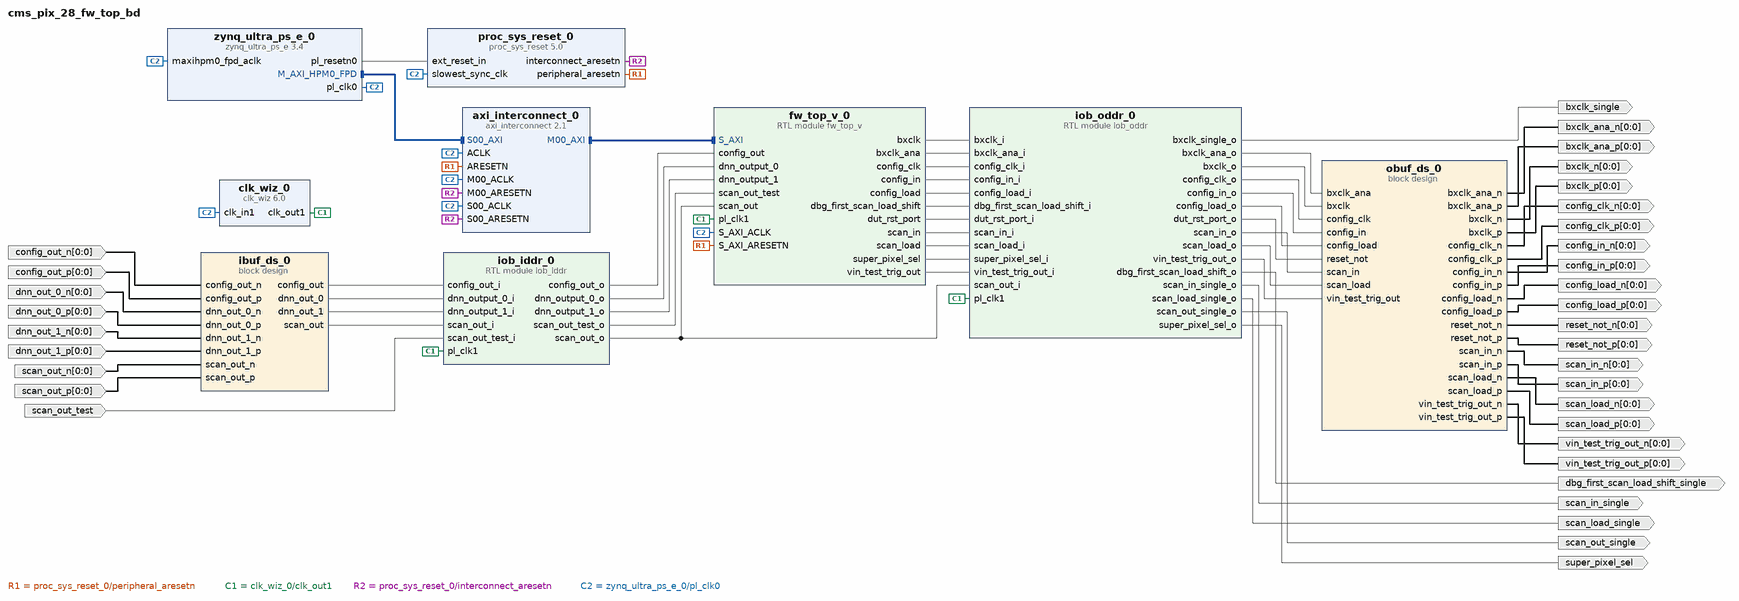
[diagram p0: block diagram of the top level]
# Vivado block design cms_pix_28_fw_top_bd, xczu9eg-ffvb1156-2-e, Vivado 2022.1
create_bd_design cms_pix_28_fw_top_bd

create_bd_port -dir O super_pixel_sel
create_bd_port -dir I scan_out_test
create_bd_port -dir I -from 0 -to 0 -type data config_out_p
create_bd_port -dir I -from 0 -to 0 -type data config_out_n
create_bd_port -dir I -from 0 -to 0 -type data scan_out_p
create_bd_port -dir I -from 0 -to 0 -type data scan_out_n
create_bd_port -dir I -from 0 -to 0 -type data dnn_out_0_p
create_bd_port -dir I -from 0 -to 0 -type data dnn_out_0_n
create_bd_port -dir I -from 0 -to 0 -type data dnn_out_1_p
create_bd_port -dir I -from 0 -to 0 -type data dnn_out_1_n
create_bd_port -dir O -from 0 -to 0 -type data scan_load_n
create_bd_port -dir O -from 0 -to 0 -type data scan_load_p
create_bd_port -dir O -from 0 -to 0 -type data scan_in_n
create_bd_port -dir O -from 0 -to 0 -type data scan_in_p
create_bd_port -dir O -from 0 -to 0 -type data vin_test_trig_out_n
create_bd_port -dir O -from 0 -to 0 -type data vin_test_trig_out_p
create_bd_port -dir O -from 0 -to 0 -type data bxclk_n
create_bd_port -dir O -from 0 -to 0 -type data bxclk_p
create_bd_port -dir O -from 0 -to 0 -type data bxclk_ana_n
create_bd_port -dir O -from 0 -to 0 -type data bxclk_ana_p
create_bd_port -dir O -from 0 -to 0 -type data config_load_n
create_bd_port -dir O -from 0 -to 0 -type data config_load_p
create_bd_port -dir O -from 0 -to 0 -type data config_in_n
create_bd_port -dir O -from 0 -to 0 -type data config_in_p
create_bd_port -dir O -from 0 -to 0 -type data config_clk_p
create_bd_port -dir O -from 0 -to 0 -type data config_clk_n
create_bd_port -dir O -from 0 -to 0 -type data reset_not_p
create_bd_port -dir O -from 0 -to 0 -type data reset_not_n
create_bd_port -dir O bxclk_single
create_bd_port -dir O scan_in_single
create_bd_port -dir O scan_out_single
create_bd_port -dir O scan_load_single
create_bd_port -dir O dbg_first_scan_load_shift_single

create_bd_cell -type ip -vlnv xilinx.com:ip:proc_sys_reset:5.0 proc_sys_reset_0
create_bd_cell -type ip -vlnv xilinx.com:ip:axi_interconnect:2.1 axi_interconnect_0
set_property -dict {CONFIG.NUM_MI 1} [get_bd_cells axi_interconnect_0]
create_bd_cell -type ip -vlnv xilinx.com:ip:zynq_ultra_ps_e:3.4 zynq_ultra_ps_e_0
set_property -dict [list \
  CONFIG.CAN0_BOARD_INTERFACE custom \
  CONFIG.CAN1_BOARD_INTERFACE custom \
  CONFIG.CSU_BOARD_INTERFACE custom \
  CONFIG.DP_BOARD_INTERFACE custom \
  CONFIG.GEM0_BOARD_INTERFACE custom \
  CONFIG.GEM1_BOARD_INTERFACE custom \
  CONFIG.GEM2_BOARD_INTERFACE custom \
  CONFIG.GEM3_BOARD_INTERFACE custom \
  CONFIG.GPIO_BOARD_INTERFACE custom \
  CONFIG.IIC0_BOARD_INTERFACE custom \
  CONFIG.IIC1_BOARD_INTERFACE custom \
  CONFIG.NAND_BOARD_INTERFACE custom \
  CONFIG.PCIE_BOARD_INTERFACE custom \
  CONFIG.PJTAG_BOARD_INTERFACE custom \
  CONFIG.PMU_BOARD_INTERFACE custom \
  CONFIG.PSU_BANK_0_IO_STANDARD LVCMOS33 \
  CONFIG.PSU_BANK_1_IO_STANDARD LVCMOS33 \
  CONFIG.PSU_BANK_2_IO_STANDARD LVCMOS33 \
  CONFIG.PSU_BANK_3_IO_STANDARD LVCMOS33 \
  CONFIG.PSU_USB3__DUAL_CLOCK_ENABLE 0 \
  CONFIG.PSU__CAN1__PERIPHERAL__ENABLE 0 \
  CONFIG.PSU__CRF_APB__ACPU_CTRL__FREQMHZ 1333.333 \
  CONFIG.PSU__CRF_APB__ACPU_CTRL__SRCSEL APLL \
  CONFIG.PSU__CRF_APB__APLL_CTRL__SRCSEL PSS_REF_CLK \
  CONFIG.PSU__CRF_APB__DBG_FPD_CTRL__FREQMHZ 250 \
  CONFIG.PSU__CRF_APB__DBG_FPD_CTRL__SRCSEL IOPLL \
  CONFIG.PSU__CRF_APB__DBG_TRACE_CTRL__FREQMHZ 250 \
  CONFIG.PSU__CRF_APB__DBG_TRACE_CTRL__SRCSEL IOPLL \
  CONFIG.PSU__CRF_APB__DBG_TSTMP_CTRL__FREQMHZ 250 \
  CONFIG.PSU__CRF_APB__DBG_TSTMP_CTRL__SRCSEL IOPLL \
  CONFIG.PSU__CRF_APB__DDR_CTRL__FREQMHZ 800 \
  CONFIG.PSU__CRF_APB__DDR_CTRL__SRCSEL DPLL \
  CONFIG.PSU__CRF_APB__DPDMA_REF_CTRL__FREQMHZ 600 \
  CONFIG.PSU__CRF_APB__DPDMA_REF_CTRL__SRCSEL DPLL \
  CONFIG.PSU__CRF_APB__DPLL_CTRL__SRCSEL PSS_REF_CLK \
  CONFIG.PSU__CRF_APB__DP_AUDIO_REF_CTRL__SRCSEL VPLL \
  CONFIG.PSU__CRF_APB__DP_STC_REF_CTRL__SRCSEL VPLL \
  CONFIG.PSU__CRF_APB__DP_VIDEO_REF_CTRL__SRCSEL DPLL \
  CONFIG.PSU__CRF_APB__GDMA_REF_CTRL__FREQMHZ 600 \
  CONFIG.PSU__CRF_APB__GDMA_REF_CTRL__SRCSEL DPLL \
  CONFIG.PSU__CRF_APB__GPU_REF_CTRL__FREQMHZ 600 \
  CONFIG.PSU__CRF_APB__GPU_REF_CTRL__SRCSEL DPLL \
  CONFIG.PSU__CRF_APB__TOPSW_LSBUS_CTRL__FREQMHZ 100 \
  CONFIG.PSU__CRF_APB__TOPSW_LSBUS_CTRL__SRCSEL IOPLL \
  CONFIG.PSU__CRF_APB__TOPSW_MAIN_CTRL__FREQMHZ 533.333 \
  CONFIG.PSU__CRF_APB__TOPSW_MAIN_CTRL__SRCSEL VPLL \
  CONFIG.PSU__CRF_APB__VPLL_CTRL__SRCSEL PSS_REF_CLK \
  CONFIG.PSU__CRL_APB__ADMA_REF_CTRL__FREQMHZ 533.333 \
  CONFIG.PSU__CRL_APB__ADMA_REF_CTRL__SRCSEL RPLL \
  CONFIG.PSU__CRL_APB__CAN1_REF_CTRL__FREQMHZ 100 \
  CONFIG.PSU__CRL_APB__CAN1_REF_CTRL__SRCSEL IOPLL \
  CONFIG.PSU__CRL_APB__CPU_R5_CTRL__FREQMHZ 533.333 \
  CONFIG.PSU__CRL_APB__CPU_R5_CTRL__SRCSEL RPLL \
  CONFIG.PSU__CRL_APB__DBG_LPD_CTRL__FREQMHZ 250 \
  CONFIG.PSU__CRL_APB__DBG_LPD_CTRL__SRCSEL IOPLL \
  CONFIG.PSU__CRL_APB__GEM3_REF_CTRL__FREQMHZ 125 \
  CONFIG.PSU__CRL_APB__GEM3_REF_CTRL__SRCSEL IOPLL \
  CONFIG.PSU__CRL_APB__I2C0_REF_CTRL__FREQMHZ 100 \
  CONFIG.PSU__CRL_APB__I2C0_REF_CTRL__SRCSEL IOPLL \
  CONFIG.PSU__CRL_APB__I2C1_REF_CTRL__FREQMHZ 100 \
  CONFIG.PSU__CRL_APB__I2C1_REF_CTRL__SRCSEL IOPLL \
  CONFIG.PSU__CRL_APB__IOPLL_CTRL__SRCSEL PSS_REF_CLK \
  CONFIG.PSU__CRL_APB__IOU_SWITCH_CTRL__FREQMHZ 267 \
  CONFIG.PSU__CRL_APB__IOU_SWITCH_CTRL__SRCSEL RPLL \
  CONFIG.PSU__CRL_APB__LPD_LSBUS_CTRL__FREQMHZ 100 \
  CONFIG.PSU__CRL_APB__LPD_LSBUS_CTRL__SRCSEL IOPLL \
  CONFIG.PSU__CRL_APB__LPD_SWITCH_CTRL__FREQMHZ 533.333 \
  CONFIG.PSU__CRL_APB__LPD_SWITCH_CTRL__SRCSEL RPLL \
  CONFIG.PSU__CRL_APB__PCAP_CTRL__FREQMHZ 200 \
  CONFIG.PSU__CRL_APB__PCAP_CTRL__SRCSEL IOPLL \
  CONFIG.PSU__CRL_APB__PL0_REF_CTRL__FREQMHZ 100 \
  CONFIG.PSU__CRL_APB__PL0_REF_CTRL__SRCSEL IOPLL \
  CONFIG.PSU__CRL_APB__QSPI_REF_CTRL__FREQMHZ 300 \
  CONFIG.PSU__CRL_APB__QSPI_REF_CTRL__SRCSEL IOPLL \
  CONFIG.PSU__CRL_APB__RPLL_CTRL__SRCSEL PSS_REF_CLK \
  CONFIG.PSU__CRL_APB__SDIO1_REF_CTRL__FREQMHZ 200 \
  CONFIG.PSU__CRL_APB__SDIO1_REF_CTRL__SRCSEL RPLL \
  CONFIG.PSU__CRL_APB__TIMESTAMP_REF_CTRL__FREQMHZ 100 \
  CONFIG.PSU__CRL_APB__TIMESTAMP_REF_CTRL__SRCSEL PSS_REF_CLK \
  CONFIG.PSU__CRL_APB__UART0_REF_CTRL__FREQMHZ 100 \
  CONFIG.PSU__CRL_APB__UART0_REF_CTRL__SRCSEL IOPLL \
  CONFIG.PSU__CRL_APB__UART1_REF_CTRL__FREQMHZ 100 \
  CONFIG.PSU__CRL_APB__UART1_REF_CTRL__SRCSEL IOPLL \
  CONFIG.PSU__CRL_APB__USB0_BUS_REF_CTRL__FREQMHZ 250 \
  CONFIG.PSU__CRL_APB__USB0_BUS_REF_CTRL__SRCSEL IOPLL \
  CONFIG.PSU__CRL_APB__USB3_DUAL_REF_CTRL__FREQMHZ 20 \
  CONFIG.PSU__CRL_APB__USB3_DUAL_REF_CTRL__SRCSEL IOPLL \
  CONFIG.PSU__CRL_APB__USB3__ENABLE 0 \
  CONFIG.PSU__CSUPMU__PERIPHERAL__VALID 0 \
  CONFIG.PSU__DDRC__BUS_WIDTH {64 Bit} \
  CONFIG.PSU__DDRC__COMPONENTS Components \
  CONFIG.PSU__DDRC__DEVICE_CAPACITY {2048 MBits} \
  CONFIG.PSU__DDRC__DRAM_WIDTH {8 Bits} \
  CONFIG.PSU__DDRC__ECC Disabled \
  CONFIG.PSU__DDRC__MEMORY_TYPE {DDR 4} \
  CONFIG.PSU__DDRC__SPEED_BIN DDR4_1600J \
  CONFIG.PSU__DDR_HIGH_ADDRESS_GUI_ENABLE 0 \
  CONFIG.PSU__DDR__INTERFACE__FREQMHZ 400.000 \
  CONFIG.PSU__DEVICE_TYPE EG \
  CONFIG.PSU__DISPLAYPORT__PERIPHERAL__ENABLE 0 \
  CONFIG.PSU__DLL__ISUSED 0 \
  CONFIG.PSU__ENET3__PERIPHERAL__ENABLE 0 \
  CONFIG.PSU__FPD_SLCR__WDT1__FREQMHZ 100 \
  CONFIG.PSU__FPGA_PL0_ENABLE 1 \
  CONFIG.PSU__GPIO0_MIO__PERIPHERAL__ENABLE 0 \
  CONFIG.PSU__GPIO1_MIO__PERIPHERAL__ENABLE 0 \
  CONFIG.PSU__I2C0__PERIPHERAL__ENABLE 0 \
  CONFIG.PSU__I2C1__PERIPHERAL__ENABLE 0 \
  CONFIG.PSU__IOU_SLCR__IOU_TTC_APB_CLK__TTC0_SEL APB \
  CONFIG.PSU__IOU_SLCR__IOU_TTC_APB_CLK__TTC1_SEL APB \
  CONFIG.PSU__IOU_SLCR__IOU_TTC_APB_CLK__TTC2_SEL APB \
  CONFIG.PSU__IOU_SLCR__IOU_TTC_APB_CLK__TTC3_SEL APB \
  CONFIG.PSU__IOU_SLCR__TTC0__FREQMHZ 100 \
  CONFIG.PSU__IOU_SLCR__TTC1__FREQMHZ 100 \
  CONFIG.PSU__IOU_SLCR__TTC2__FREQMHZ 100 \
  CONFIG.PSU__IOU_SLCR__TTC3__FREQMHZ 100 \
  CONFIG.PSU__IOU_SLCR__WDT0__FREQMHZ 100 \
  CONFIG.PSU__LPD_SLCR__CSUPMU__FREQMHZ 100 \
  CONFIG.PSU__MAXIGP0__DATA_WIDTH 128 \
  CONFIG.PSU__OVERRIDE_HPX_QOS 0 \
  CONFIG.PSU__OVERRIDE__BASIC_CLOCK 0 \
  CONFIG.PSU__PMU__PERIPHERAL__ENABLE 0 \
  CONFIG.PSU__PRESET_APPLIED 0 \
  CONFIG.PSU__PSS_REF_CLK__FREQMHZ 33.333 \
  CONFIG.PSU__QSPI__PERIPHERAL__ENABLE 0 \
  CONFIG.PSU__SATA__PERIPHERAL__ENABLE 0 \
  CONFIG.PSU__SD0__CLK_100_SDR_OTAP_DLY 0x3 \
  CONFIG.PSU__SD0__CLK_200_SDR_OTAP_DLY 0x3 \
  CONFIG.PSU__SD0__CLK_50_DDR_ITAP_DLY 0x3D \
  CONFIG.PSU__SD0__CLK_50_DDR_OTAP_DLY 0x4 \
  CONFIG.PSU__SD0__CLK_50_SDR_ITAP_DLY 0x15 \
  CONFIG.PSU__SD0__CLK_50_SDR_OTAP_DLY 0x5 \
  CONFIG.PSU__SD1__CLK_100_SDR_OTAP_DLY 0x3 \
  CONFIG.PSU__SD1__CLK_200_SDR_OTAP_DLY 0x3 \
  CONFIG.PSU__SD1__CLK_50_DDR_ITAP_DLY 0x3D \
  CONFIG.PSU__SD1__CLK_50_DDR_OTAP_DLY 0x4 \
  CONFIG.PSU__SD1__CLK_50_SDR_ITAP_DLY 0x15 \
  CONFIG.PSU__SD1__CLK_50_SDR_OTAP_DLY 0x5 \
  CONFIG.PSU__SD1__PERIPHERAL__ENABLE 0 \
  CONFIG.PSU__SWDT0__PERIPHERAL__ENABLE 0 \
  CONFIG.PSU__SWDT1__PERIPHERAL__ENABLE 0 \
  CONFIG.PSU__TTC0__PERIPHERAL__ENABLE 0 \
  CONFIG.PSU__TTC1__PERIPHERAL__ENABLE 0 \
  CONFIG.PSU__TTC2__PERIPHERAL__ENABLE 0 \
  CONFIG.PSU__TTC3__PERIPHERAL__ENABLE 0 \
  CONFIG.PSU__UART0__PERIPHERAL__ENABLE 0 \
  CONFIG.PSU__UART1__PERIPHERAL__ENABLE 0 \
  CONFIG.PSU__USB0__PERIPHERAL__ENABLE 0 \
  CONFIG.PSU__USE__IRQ0 0 \
  CONFIG.PSU__USE__M_AXI_GP0 1 \
  CONFIG.PSU__USE__M_AXI_GP1 0 \
  CONFIG.PSU__USE__M_AXI_GP2 0 \
  CONFIG.QSPI_BOARD_INTERFACE custom \
  CONFIG.SATA_BOARD_INTERFACE custom \
  CONFIG.SD0_BOARD_INTERFACE custom \
  CONFIG.SD1_BOARD_INTERFACE custom \
  CONFIG.SPI0_BOARD_INTERFACE custom \
  CONFIG.SPI1_BOARD_INTERFACE custom \
  CONFIG.SUBPRESET1 Custom \
  CONFIG.SUBPRESET2 Custom \
  CONFIG.SWDT0_BOARD_INTERFACE custom \
  CONFIG.SWDT1_BOARD_INTERFACE custom \
  CONFIG.TRACE_BOARD_INTERFACE custom \
  CONFIG.TTC0_BOARD_INTERFACE custom \
  CONFIG.TTC1_BOARD_INTERFACE custom \
  CONFIG.TTC2_BOARD_INTERFACE custom \
  CONFIG.TTC3_BOARD_INTERFACE custom \
  CONFIG.UART0_BOARD_INTERFACE custom \
  CONFIG.UART1_BOARD_INTERFACE custom \
  CONFIG.USB0_BOARD_INTERFACE custom \
  CONFIG.USB1_BOARD_INTERFACE custom \
  CONFIG.preset None \
] [get_bd_cells zynq_ultra_ps_e_0]
# 747 more settings of zynq_ultra_ps_e_0 are not shown: defaults, MIO pin electricals, DDR timing, and values the tool derives
create_bd_cell -type container -reference ibuf_ds ibuf_ds_0
set_property -dict [list \
  CONFIG.ACTIVE_SIM_BD ibuf_ds.bd \
  CONFIG.ACTIVE_SYNTH_BD ibuf_ds.bd \
  CONFIG.ENABLE_DFX 0 \
  CONFIG.LIST_SIM_BD ibuf_ds.bd \
  CONFIG.LIST_SYNTH_BD ibuf_ds.bd \
  CONFIG.LOCK_PROPAGATE 0 \
] [get_bd_cells ibuf_ds_0]
create_bd_cell -type container -reference obuf_ds obuf_ds_0
set_property -dict [list \
  CONFIG.ACTIVE_SIM_BD obuf_ds.bd \
  CONFIG.ACTIVE_SYNTH_BD obuf_ds.bd \
  CONFIG.ENABLE_DFX 0 \
  CONFIG.LIST_SIM_BD obuf_ds.bd \
  CONFIG.LIST_SYNTH_BD obuf_ds.bd \
  CONFIG.LOCK_PROPAGATE 0 \
] [get_bd_cells obuf_ds_0]
create_bd_cell -type ip -vlnv xilinx.com:ip:clk_wiz:6.0 clk_wiz_0
set_property -dict [list \
  CONFIG.AUTO_PRIMITIVE MMCM \
  CONFIG.CLKOUT1_DRIVES Buffer \
  CONFIG.CLKOUT1_JITTER 90.075 \
  CONFIG.CLKOUT1_PHASE_ERROR 87.181 \
  CONFIG.CLKOUT1_REQUESTED_OUT_FREQ 399.99600 \
  CONFIG.CLKOUT2_DRIVES Buffer \
  CONFIG.CLKOUT3_DRIVES Buffer \
  CONFIG.CLKOUT4_DRIVES Buffer \
  CONFIG.CLKOUT5_DRIVES Buffer \
  CONFIG.CLKOUT6_DRIVES Buffer \
  CONFIG.CLKOUT7_DRIVES Buffer \
  CONFIG.FEEDBACK_SOURCE FDBK_AUTO \
  CONFIG.MMCM_BANDWIDTH OPTIMIZED \
  CONFIG.MMCM_CLKFBOUT_MULT_F 12.000 \
  CONFIG.MMCM_CLKOUT0_DIVIDE_F 3.000 \
  CONFIG.MMCM_COMPENSATION AUTO \
  CONFIG.OPTIMIZE_CLOCKING_STRUCTURE_EN true \
  CONFIG.PRIMITIVE Auto \
  CONFIG.PRIM_SOURCE No_buffer \
  CONFIG.SECONDARY_SOURCE Single_ended_clock_capable_pin \
  CONFIG.USE_LOCKED false \
  CONFIG.USE_PHASE_ALIGNMENT true \
  CONFIG.USE_RESET false \
] [get_bd_cells clk_wiz_0]
create_bd_cell -type module -reference iob_iddr iob_iddr_0
create_bd_cell -type module -reference iob_oddr iob_oddr_0
create_bd_cell -type module -reference fw_top_v fw_top_v_0

# ---- connections ----

connect_bd_intf_net [get_bd_intf_pins fw_top_v_0/S_AXI] [get_bd_intf_pins axi_interconnect_0/M00_AXI]
connect_bd_intf_net [get_bd_intf_pins zynq_ultra_ps_e_0/M_AXI_HPM0_FPD] [get_bd_intf_pins axi_interconnect_0/S00_AXI]
connect_bd_net -net ARESETN_1 [get_bd_pins proc_sys_reset_0/peripheral_aresetn] \
  [get_bd_pins axi_interconnect_0/ARESETN] [get_bd_pins fw_top_v_0/S_AXI_ARESETN]
connect_bd_net [get_bd_pins clk_wiz_0/clk_out1] [get_bd_pins iob_iddr_0/pl_clk1] [get_bd_pins iob_oddr_0/pl_clk1] [get_bd_pins fw_top_v_0/pl_clk1]
connect_bd_net [get_bd_ports config_out_n] [get_bd_pins ibuf_ds_0/config_out_n]
connect_bd_net [get_bd_ports config_out_p] [get_bd_pins ibuf_ds_0/config_out_p]
connect_bd_net [get_bd_ports dnn_out_0_n] [get_bd_pins ibuf_ds_0/dnn_out_0_n]
connect_bd_net [get_bd_ports dnn_out_0_p] [get_bd_pins ibuf_ds_0/dnn_out_0_p]
connect_bd_net [get_bd_ports dnn_out_1_n] [get_bd_pins ibuf_ds_0/dnn_out_1_n]
connect_bd_net [get_bd_ports dnn_out_1_p] [get_bd_pins ibuf_ds_0/dnn_out_1_p]
connect_bd_net [get_bd_pins fw_top_v_0/bxclk] [get_bd_pins iob_oddr_0/bxclk_i]
connect_bd_net [get_bd_pins fw_top_v_0/bxclk_ana] [get_bd_pins iob_oddr_0/bxclk_ana_i]
connect_bd_net [get_bd_pins fw_top_v_0/config_clk] [get_bd_pins iob_oddr_0/config_clk_i]
connect_bd_net [get_bd_pins fw_top_v_0/config_in] [get_bd_pins iob_oddr_0/config_in_i]
connect_bd_net [get_bd_pins fw_top_v_0/config_load] [get_bd_pins iob_oddr_0/config_load_i]
connect_bd_net [get_bd_pins fw_top_v_0/dbg_first_scan_load_shift] [get_bd_pins iob_oddr_0/dbg_first_scan_load_shift_i]
connect_bd_net [get_bd_pins fw_top_v_0/dut_rst_port] [get_bd_pins iob_oddr_0/dut_rst_port_i]
connect_bd_net [get_bd_pins fw_top_v_0/scan_in] [get_bd_pins iob_oddr_0/scan_in_i]
connect_bd_net [get_bd_pins fw_top_v_0/scan_load] [get_bd_pins iob_oddr_0/scan_load_i]
connect_bd_net [get_bd_pins fw_top_v_0/super_pixel_sel] [get_bd_pins iob_oddr_0/super_pixel_sel_i]
connect_bd_net [get_bd_pins fw_top_v_0/vin_test_trig_out] [get_bd_pins iob_oddr_0/vin_test_trig_out_i]
connect_bd_net [get_bd_pins ibuf_ds_0/config_out] [get_bd_pins iob_iddr_0/config_out_i]
connect_bd_net [get_bd_pins ibuf_ds_0/dnn_out_0] [get_bd_pins iob_iddr_0/dnn_output_0_i]
connect_bd_net [get_bd_pins ibuf_ds_0/dnn_out_1] [get_bd_pins iob_iddr_0/dnn_output_1_i]
connect_bd_net [get_bd_pins ibuf_ds_0/scan_out] [get_bd_pins iob_iddr_0/scan_out_i]
connect_bd_net [get_bd_pins iob_iddr_0/config_out_o] [get_bd_pins fw_top_v_0/config_out]
connect_bd_net [get_bd_pins iob_iddr_0/dnn_output_0_o] [get_bd_pins fw_top_v_0/dnn_output_0]
connect_bd_net [get_bd_pins iob_iddr_0/dnn_output_1_o] [get_bd_pins fw_top_v_0/dnn_output_1]
connect_bd_net [get_bd_pins iob_iddr_0/scan_out_o] [get_bd_pins iob_oddr_0/scan_out_i] [get_bd_pins fw_top_v_0/scan_out]
connect_bd_net [get_bd_pins iob_iddr_0/scan_out_test_o] [get_bd_pins fw_top_v_0/scan_out_test]
connect_bd_net [get_bd_pins iob_oddr_0/bxclk_ana_o] [get_bd_pins obuf_ds_0/bxclk_ana]
connect_bd_net [get_bd_pins iob_oddr_0/bxclk_o] [get_bd_pins obuf_ds_0/bxclk]
connect_bd_net [get_bd_pins iob_oddr_0/bxclk_single_o] [get_bd_ports bxclk_single]
connect_bd_net [get_bd_pins iob_oddr_0/config_clk_o] [get_bd_pins obuf_ds_0/config_clk]
connect_bd_net [get_bd_pins iob_oddr_0/config_in_o] [get_bd_pins obuf_ds_0/config_in]
connect_bd_net [get_bd_pins iob_oddr_0/config_load_o] [get_bd_pins obuf_ds_0/config_load]
connect_bd_net [get_bd_pins iob_oddr_0/dbg_first_scan_load_shift_o] [get_bd_ports dbg_first_scan_load_shift_single]
connect_bd_net [get_bd_pins iob_oddr_0/dut_rst_port_o] [get_bd_pins obuf_ds_0/reset_not]
connect_bd_net [get_bd_pins iob_oddr_0/scan_in_o] [get_bd_pins obuf_ds_0/scan_in]
connect_bd_net [get_bd_pins iob_oddr_0/scan_in_single_o] [get_bd_ports scan_in_single]
connect_bd_net [get_bd_pins iob_oddr_0/scan_load_o] [get_bd_pins obuf_ds_0/scan_load]
connect_bd_net [get_bd_pins iob_oddr_0/scan_load_single_o] [get_bd_ports scan_load_single]
connect_bd_net [get_bd_pins iob_oddr_0/scan_out_single_o] [get_bd_ports scan_out_single]
connect_bd_net [get_bd_pins iob_oddr_0/super_pixel_sel_o] [get_bd_ports super_pixel_sel]
connect_bd_net [get_bd_pins iob_oddr_0/vin_test_trig_out_o] [get_bd_pins obuf_ds_0/vin_test_trig_out]
connect_bd_net [get_bd_pins obuf_ds_0/bxclk_ana_n] [get_bd_ports bxclk_ana_n]
connect_bd_net [get_bd_pins obuf_ds_0/bxclk_ana_p] [get_bd_ports bxclk_ana_p]
connect_bd_net [get_bd_pins obuf_ds_0/bxclk_n] [get_bd_ports bxclk_n]
connect_bd_net [get_bd_pins obuf_ds_0/bxclk_p] [get_bd_ports bxclk_p]
connect_bd_net [get_bd_pins obuf_ds_0/config_clk_n] [get_bd_ports config_clk_n]
connect_bd_net [get_bd_pins obuf_ds_0/config_clk_p] [get_bd_ports config_clk_p]
connect_bd_net [get_bd_pins obuf_ds_0/config_in_n] [get_bd_ports config_in_n]
connect_bd_net [get_bd_pins obuf_ds_0/config_in_p] [get_bd_ports config_in_p]
connect_bd_net [get_bd_pins obuf_ds_0/config_load_n] [get_bd_ports config_load_n]
connect_bd_net [get_bd_pins obuf_ds_0/config_load_p] [get_bd_ports config_load_p]
connect_bd_net [get_bd_pins obuf_ds_0/reset_not_n] [get_bd_ports reset_not_n]
connect_bd_net [get_bd_pins obuf_ds_0/reset_not_p] [get_bd_ports reset_not_p]
connect_bd_net [get_bd_pins obuf_ds_0/scan_in_n] [get_bd_ports scan_in_n]
connect_bd_net [get_bd_pins obuf_ds_0/scan_in_p] [get_bd_ports scan_in_p]
connect_bd_net [get_bd_pins obuf_ds_0/scan_load_n] [get_bd_ports scan_load_n]
connect_bd_net [get_bd_pins obuf_ds_0/scan_load_p] [get_bd_ports scan_load_p]
connect_bd_net [get_bd_pins obuf_ds_0/vin_test_trig_out_n] [get_bd_ports vin_test_trig_out_n]
connect_bd_net [get_bd_pins obuf_ds_0/vin_test_trig_out_p] [get_bd_ports vin_test_trig_out_p]
connect_bd_net [get_bd_pins proc_sys_reset_0/interconnect_aresetn] \
  [get_bd_pins axi_interconnect_0/S00_ARESETN] [get_bd_pins axi_interconnect_0/M00_ARESETN]
connect_bd_net [get_bd_ports scan_out_n] [get_bd_pins ibuf_ds_0/scan_out_n]
connect_bd_net [get_bd_ports scan_out_p] [get_bd_pins ibuf_ds_0/scan_out_p]
connect_bd_net [get_bd_ports scan_out_test] [get_bd_pins iob_iddr_0/scan_out_test_i]
connect_bd_net [get_bd_pins zynq_ultra_ps_e_0/pl_clk0] \
  [get_bd_pins proc_sys_reset_0/slowest_sync_clk] [get_bd_pins axi_interconnect_0/ACLK] \
  [get_bd_pins axi_interconnect_0/S00_ACLK] [get_bd_pins axi_interconnect_0/M00_ACLK] \
  [get_bd_pins zynq_ultra_ps_e_0/maxihpm0_fpd_aclk] [get_bd_pins clk_wiz_0/clk_in1] [get_bd_pins fw_top_v_0/S_AXI_ACLK]
connect_bd_net [get_bd_pins zynq_ultra_ps_e_0/pl_resetn0] [get_bd_pins proc_sys_reset_0/ext_reset_in]

# ---- address map ----
assign_bd_address -offset 0x0400000000 -range 4K -target_address_space [get_bd_addr_spaces zynq_ultra_ps_e_0/Data] [get_bd_addr_segs fw_top_v_0/S_AXI/reg0]

validate_bd_design
save_bd_design
